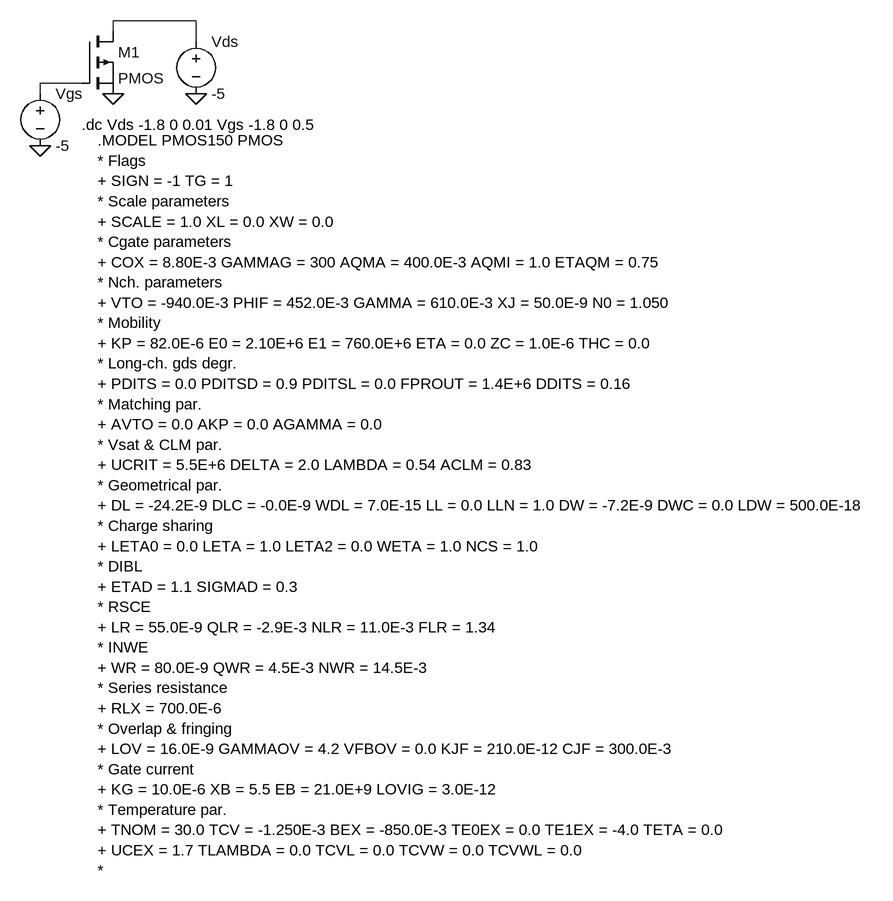
[diagram p0: schematic pmos output char.asc]
pmos output char.asc, the LTspice schematic file:
Version 4
SHEET 1 1432 1320
WIRE 304 112 176 112
WIRE 176 128 176 112
WIRE 304 144 304 112
WIRE 128 208 64 208
WIRE 64 224 64 208
FLAG 64 304 0
FLAG 176 224 0
FLAG 304 224 0
SYMBOL pmos 128 128 R0
SYMATTR InstName M1
SYMBOL voltage 304 128 R0
WINDOW 123 0 0 Left 0
WINDOW 39 0 0 Left 0
SYMATTR InstName Vds
SYMATTR Value -5
SYMBOL voltage 64 208 R0
WINDOW 123 0 0 Left 0
WINDOW 39 0 0 Left 0
SYMATTR InstName Vgs
SYMATTR Value -5
TEXT 128 272 Left 2 !.dc Vds -1.8 0 0.01 Vgs -1.8 0 0.5
TEXT 152 296 Left 2 !.MODEL PMOS150 PMOS \n* Flags\n+ SIGN = -1 TG = 1\n* Scale parameters\n+ SCALE = 1.0 XL = 0.0 XW = 0.0\n* Cgate parameters\n+ COX = 8.80E-3 GAMMAG = 300 AQMA = 400.0E-3 AQMI = 1.0 ETAQM = 0.75\n* Nch. parameters \n+ VTO = -940.0E-3 PHIF = 452.0E-3 GAMMA = 610.0E-3 XJ = 50.0E-9 N0 = 1.050\n* Mobility\n+ KP = 82.0E-6 E0 = 2.10E+6 E1 = 760.0E+6 ETA = 0.0 ZC = 1.0E-6 THC = 0.0\n* Long-ch. gds degr.\n+ PDITS = 0.0 PDITSD = 0.9 PDITSL = 0.0 FPROUT = 1.4E+6 DDITS = 0.16\n* Matching par.\n+ AVTO = 0.0 AKP = 0.0 AGAMMA = 0.0\n* Vsat & CLM par. \n+ UCRIT = 5.5E+6 DELTA = 2.0 LAMBDA = 0.54 ACLM = 0.83 \n* Geometrical par.\n+ DL = -24.2E-9 DLC = -0.0E-9 WDL = 7.0E-15 LL = 0.0 LLN = 1.0 DW = -7.2E-9 DWC = 0.0 LDW = 500.0E-18\n* Charge sharing\n+ LETA0 = 0.0 LETA = 1.0 LETA2 = 0.0 WETA = 1.0 NCS = 1.0\n* DIBL\n+ ETAD = 1.1 SIGMAD = 0.3\n* RSCE\n+ LR = 55.0E-9 QLR = -2.9E-3 NLR = 11.0E-3 FLR = 1.34\n* INWE\n+ WR = 80.0E-9 QWR = 4.5E-3 NWR = 14.5E-3\n* Series resistance\n+ RLX = 700.0E-6\n* Overlap & fringing\n+ LOV = 16.0E-9 GAMMAOV = 4.2 VFBOV = 0.0 KJF = 210.0E-12 CJF = 300.0E-3\n* Gate current\n+ KG = 10.0E-6 XB = 5.5 EB = 21.0E+9 LOVIG = 3.0E-12\n* Temperature par.\n+ TNOM = 30.0 TCV = -1.250E-3 BEX = -850.0E-3 TE0EX = 0.0 TE1EX = -4.0 TETA = 0.0 \n+ UCEX = 1.7 TLAMBDA = 0.0 TCVL = 0.0 TCVW = 0.0 TCVWL = 0.0\n*

The netlist it stands for:
* pmos output char.asc
M1 N001 N002 0 0 PMOS
Vds N001 0 -5
Vgs N002 0 -5
.model NMOS NMOS
.model PMOS PMOS
.lib standard.mos
.dc Vds -1.8 0 0.01 Vgs -1.8 0 0.5
.MODEL PMOS150 PMOS
* Flags
+ SIGN = -1 TG = 1
* Scale parameters
+ SCALE = 1.0 XL = 0.0 XW = 0.0
* Cgate parameters
+ COX = 8.80E-3 GAMMAG = 300 AQMA = 400.0E-3 AQMI = 1.0 ETAQM = 0.75
* Nch. parameters
+ VTO = -940.0E-3 PHIF = 452.0E-3 GAMMA = 610.0E-3 XJ = 50.0E-9 N0 = 1.050
* Mobility
+ KP = 82.0E-6 E0 = 2.10E+6 E1 = 760.0E+6 ETA = 0.0 ZC = 1.0E-6 THC = 0.0
* Long-ch. gds degr.
+ PDITS = 0.0 PDITSD = 0.9 PDITSL = 0.0 FPROUT = 1.4E+6 DDITS = 0.16
* Matching par.
+ AVTO = 0.0 AKP = 0.0 AGAMMA = 0.0
* Vsat & CLM par.
+ UCRIT = 5.5E+6 DELTA = 2.0 LAMBDA = 0.54 ACLM = 0.83
* Geometrical par.
+ DL = -24.2E-9 DLC = -0.0E-9 WDL = 7.0E-15 LL = 0.0 LLN = 1.0 DW = -7.2E-9 DWC = 0.0 LDW = 500.0E-18
* Charge sharing
+ LETA0 = 0.0 LETA = 1.0 LETA2 = 0.0 WETA = 1.0 NCS = 1.0
* DIBL
+ ETAD = 1.1 SIGMAD = 0.3
* RSCE
+ LR = 55.0E-9 QLR = -2.9E-3 NLR = 11.0E-3 FLR = 1.34
* INWE
+ WR = 80.0E-9 QWR = 4.5E-3 NWR = 14.5E-3
* Series resistance
+ RLX = 700.0E-6
* Overlap & fringing
+ LOV = 16.0E-9 GAMMAOV = 4.2 VFBOV = 0.0 KJF = 210.0E-12 CJF = 300.0E-3
* Gate current
+ KG = 10.0E-6 XB = 5.5 EB = 21.0E+9 LOVIG = 3.0E-12
* Temperature par.
+ TNOM = 30.0 TCV = -1.250E-3 BEX = -850.0E-3 TE0EX = 0.0 TE1EX = -4.0 TETA = 0.0
+ UCEX = 1.7 TLAMBDA = 0.0 TCVL = 0.0 TCVW = 0.0 TCVWL = 0.0
*
.backanno
.end